# EAGLE schematic soccerbotsqr (EAGLE 8.2.2)

## Sheet 1 of 4
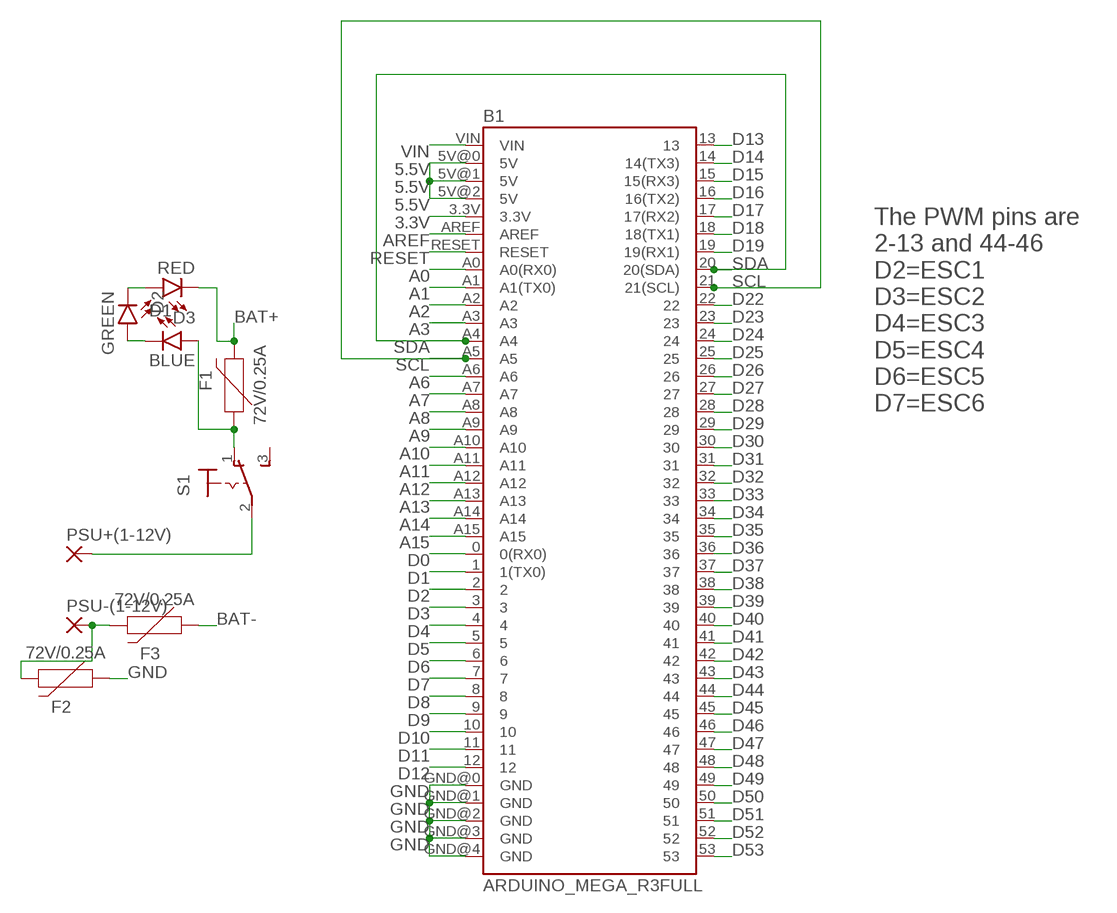
[diagram p0: schematic, sheet 1]

### Parts
B1  ARDUINO_MEGA_R3FULL  [ARDUINO_MEGA]
D1  BLUE  LED-BLUE1206  [LED-1206]
D2  GREEN  LED-GREEN0603  [LED-0603]
D3  RED  LED-RED0603  [LED-0603]
F1  72V/0.25A  PPTC_PTH  [PTH]
F2  72V/0.25A  PPTC_PTH  [PTH]
F3  72V/0.25A  PPTC_PTH  [PTH]
PSU+(1-12V)  SMD5  [SMD2,54-5,08]
PSU-(1-12V)  SMD5  [SMD2,54-5,08]
S1  320-916  [320-916]

### Nets
3.3V: B1.3.3V ; also sheet 2
5.5V: B1.5V@0(5V) B1.5V@1(5V) B1.5V@2(5V)
A0: B1.A0(A0(RX0))
A1: B1.A1(A1(TX0))
A2: B1.A2
A3: B1.A3
A6: B1.A6
A7: B1.A7
A8: B1.A8
A9: B1.A9
A10: B1.A10
A11: B1.A11
A12: B1.A12
A13: B1.A13
A14: B1.A14
A15: B1.A15
AREF: B1.AREF
BAT+: D3.C F1.P$2 ; also sheet 4
BAT-: F2.P$2 F3.P$1 F3.P$2 PSU-(1-12V).1(P) ; also sheet 4
D0: B1.0(0(RX0))
D1: B1.1(1(TX0))
D2: B1.2 ; also sheet 4
D3: B1.3 ; also sheet 4
D4: B1.4 ; also sheet 4
D5: B1.5 ; also sheet 4
D6: B1.6 ; also sheet 4
D7: B1.7 ; also sheet 4
D8: B1.8
D9: B1.9
D10: B1.10
D11: B1.11
D12: B1.12
D13: B1.13
D14: B1.14(14(TX3))
D15: B1.15(15(RX3))
D16: B1.16(16(TX2))
D17: B1.17(17(RX2))
D18: B1.18(18(TX1))
D19: B1.19(19(RX1))
D22: B1.22
D23: B1.23
D24: B1.24
D25: B1.25
D26: B1.26
D27: B1.27
D28: B1.28
D29: B1.29
D30: B1.30
D31: B1.31
D32: B1.32
D33: B1.33
D34: B1.34
D35: B1.35
D36: B1.36
D37: B1.37
D38: B1.38
D39: B1.39
D40: B1.40
D41: B1.41
D42: B1.42
D43: B1.43
D44: B1.44
D45: B1.45
D46: B1.46
D47: B1.47
D48: B1.48
D49: B1.49
D50: B1.50
D51: B1.51
D52: B1.52
D53: B1.53
GND: B1.GND@0(GND) B1.GND@1(GND) B1.GND@2(GND) B1.GND@3(GND) B1.GND@4(GND) F2.P$1 ; also sheet 2,3,4
N$3: D1.C D2.A
N$4: PSU+(1-12V).1(P) S1.2(P)
N$5: D2.C D3.A
N$6: D1.A F1.P$1 S1.1(O)
RESET: B1.RESET
SCL: B1.21(21(SCL)) B1.A5 ; also sheet 2,3
SDA: B1.20(20(SDA)) B1.A4 ; also sheet 2,3
VIN: B1.VIN ; also sheet 2,3,4
Unconnected: S1.3(S)

### Notes on the sheet
- The PWM pins are
  2-13 and 44-46
  D2=ESC1
  D3=ESC2
  D4=ESC3
  D5=ESC4
  D6=ESC5
  D7=ESC6

## Sheet 2 of 4
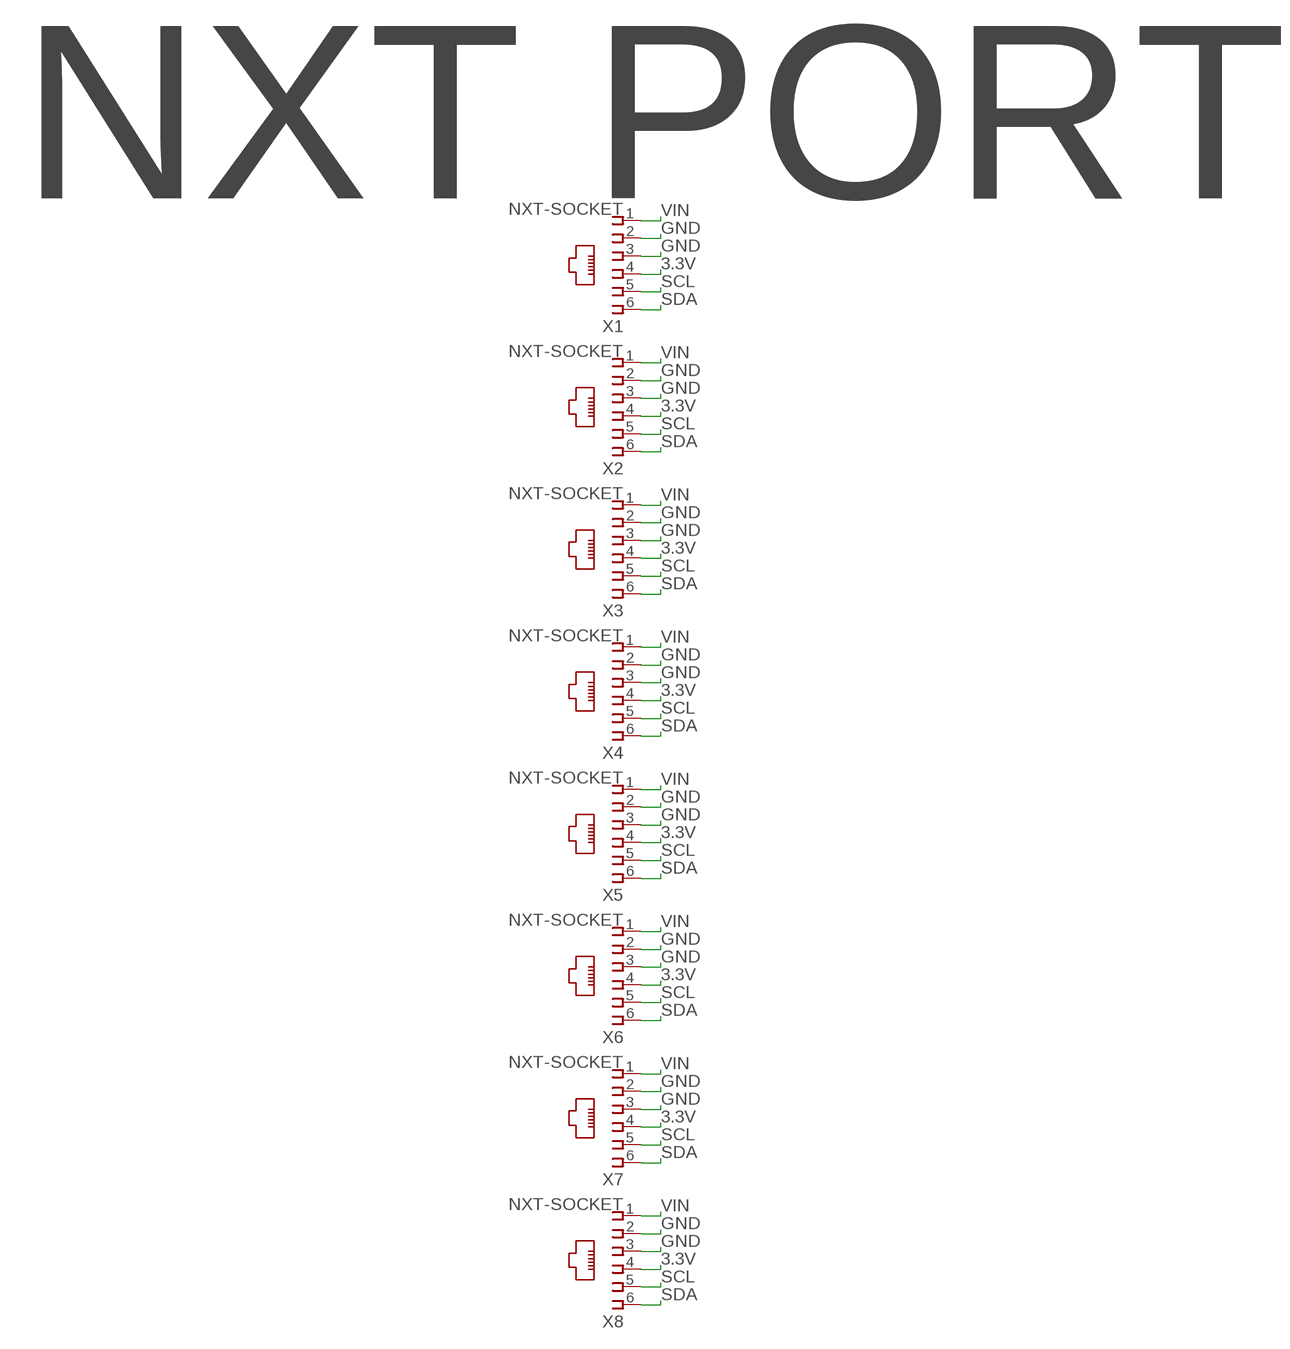
[diagram p1: schematic, sheet 2]

### Parts
X1  NXT-SOCKET  [NXT-SOCKET]
X2  NXT-SOCKET  [NXT-SOCKET]
X3  NXT-SOCKET  [NXT-SOCKET]
X4  NXT-SOCKET  [NXT-SOCKET]
X5  NXT-SOCKET  [NXT-SOCKET]
X6  NXT-SOCKET  [NXT-SOCKET]
X7  NXT-SOCKET  [NXT-SOCKET]
X8  NXT-SOCKET  [NXT-SOCKET]

### Nets
3.3V: X1.4 X2.4 X3.4 X4.4 X5.4 X6.4 X7.4 X8.4 ; also sheet 1
GND: X1.2 X1.3 X2.2 X2.3 X3.2 X3.3 X4.2 X4.3 X5.2 X5.3 X6.2 X6.3 X7.2 X7.3 X8.2 X8.3 ; also sheet 1,3,4
SCL: X1.5 X2.5 X3.5 X4.5 X5.5 X6.5 X7.5 X8.5 ; also sheet 1,3
SDA: X1.6 X2.6 X3.6 X4.6 X5.6 X6.6 X7.6 X8.6 ; also sheet 1,3
VIN: X1.1 X2.1 X3.1 X4.1 X5.1 X6.1 X7.1 X8.1 ; also sheet 1,3,4

### Notes on the sheet
- NXT PORTS

## Sheet 3 of 4
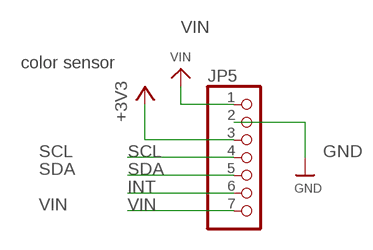
[diagram p2: schematic, sheet 3]

### Parts
JP5  HEADER-1X770MIL  [1X07_ROUND_70]

### Nets
+3V3: JP5.3
GND: JP5.2 ; also sheet 1,2,4
INT: JP5.6
SCL: JP5.4 ; also sheet 1,2
SDA: JP5.5 ; also sheet 1,2
VIN: JP5.1 JP5.7 ; also sheet 1,2,4

### Notes on the sheet
- color sensor

## Sheet 4 of 4
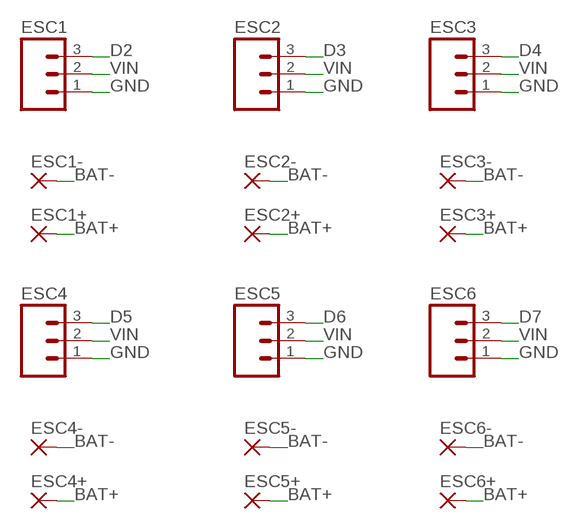
[diagram p3: schematic, sheet 4]

### Parts
ESC1  M03LOCK  [1X03_LOCK]
ESC1+  SMD5  [SMD2,54-5,08]
ESC1-  SMD5  [SMD2,54-5,08]
ESC2  M03LOCK  [1X03_LOCK]
ESC2+  SMD5  [SMD2,54-5,08]
ESC2-  SMD5  [SMD2,54-5,08]
ESC3  M03LOCK  [1X03_LOCK]
ESC3+  SMD5  [SMD2,54-5,08]
ESC3-  SMD5  [SMD2,54-5,08]
ESC4  M03LOCK  [1X03_LOCK]
ESC4+  SMD5  [SMD2,54-5,08]
ESC4-  SMD5  [SMD2,54-5,08]
ESC5  M03LOCK  [1X03_LOCK]
ESC5+  SMD5  [SMD2,54-5,08]
ESC5-  SMD5  [SMD2,54-5,08]
ESC6  M03LOCK  [1X03_LOCK]
ESC6+  SMD5  [SMD2,54-5,08]
ESC6-  SMD5  [SMD2,54-5,08]

### Nets
BAT+: ESC1+.1(P) ESC2+.1(P) ESC3+.1(P) ESC4+.1(P) ESC5+.1(P) ESC6+.1(P) ; also sheet 1
BAT-: ESC1-.1(P) ESC2-.1(P) ESC3-.1(P) ESC4-.1(P) ESC5-.1(P) ESC6-.1(P) ; also sheet 1
D2: ESC1.3 ; also sheet 1
D3: ESC2.3 ; also sheet 1
D4: ESC3.3 ; also sheet 1
D5: ESC4.3 ; also sheet 1
D6: ESC5.3 ; also sheet 1
D7: ESC6.3 ; also sheet 1
GND: ESC1.1 ESC2.1 ESC3.1 ESC4.1 ESC5.1 ESC6.1 ; also sheet 1,2,3
VIN: ESC1.2 ESC2.2 ESC3.2 ESC4.2 ESC5.2 ESC6.2 ; also sheet 1,2,3

## Library data of the parts
B1 = SparkFun-Boards:ARDUINO_MEGA_R3: Arduino Mega R3 ATmega2560 R3 compatible footprint. SparkFun Products: Arduino Mega 2560 R3 <https://www.sparkfun.com/products/11061>; OC_NEWARK: unknown
D1 = SparkFun-LED:LED-BLUE: Blue SMD LED Used in manufacturing of various products at SparkFun Packages: 0603 - SMD 0603 package [Product Link] <http://www.digikey.com/product-detail/en/SMLE12BC7TT86/511-1589-2-ND/1641808> 1206 - SMD1206 package [Product Link] <http://www.digikey.com/product-detail/en/lite-on-inc/LTST-C150TBKT/160-1643-1-ND/573584> SparkFun Products: ESP8266 Thing-Dev Board <https://www.sparkfun.com/products/13711> RedBoard <https://www.sparkfun.com/products/12757>; MPN: TLMB1100-GS08; OC_NEWARK: 03P9480; PROD_ID: DIO-09911
D2 = SparkFun-LED:LED-GREEN: Green SMD LED Used in manufacturing of various products at SparkFun Packages: 0603 - SMD 0603 package [Product Link] <http://www.futureelectronics.com/en/technologies/semiconductors/optoelectronics/leds/Pages/9894312-LTST-C190GKT.aspx?CrossPart=HSMG-C190&IM=0> LilyPad 1206 - SMD1206 LilyPad package [Product Link] <http://www.futureelectronics.com/en/Technologies/Product.aspx?ProductID=IN150NGHARVATEKCORPORATION2049943&IM=0> 1206 - SMD1206 package [Product Link] <http://www.futureelectronics.com/en/technologies/semiconductors/optoelectronics/leds/Pages/8315665-LTST-C150KGKT.aspx?IM=0> 1206 Bottom Mount -SMD 1206 Bottom Mount [Product Link] <http://www.digikey.com/product-detail/en/lite-on-inc/LTST-C230KGKT/160-1456-1-ND/386854> SparkFun Products: Pro Mini 328 -5V <https://www.sparkfun.com/products/821> RedBoard <https://www.sparkfun.com/products/12757> MP3 Trigger <https://www.sparkfun.com/products/13720> Makey Makey <https://www.sparkfun.com/products/11076>; MF: SLI (CML/IDI); MPN: CMD15-21VGC/TR8; OC_NEWARK: 15M8857; PROD_ID: DIO-00821
D3 = SparkFun-LED:LED-RED: Red SMD LED Used in manufacturing of most products at SparkFun Packages: 0603 - SMD 0603 package [Product Link] <http://docs.avagotech.com/docs/AV02-0551EN> 0603 SMART - SMD 0603 SMART package ( more efficient and expensive)[Product Link] <http://www.osram-os.com/Graphics/XPic2/00077099_0.pdf> 1206 - SMD1206 package [Product Link] <https://www.sparkfun.com/datasheets/DevTools/LilyPad/Q150OVS4.pdff> SparkFun Products: Pro Mini 328 -5V <https://www.sparkfun.com/products/821> RedBoard <https://www.sparkfun.com/products/12757> IOIO-OTG <https://www.sparkfun.com/products/13613>; MPN: LSQ976-Z; OC_NEWARK: 05M0541; PROD_ID: DIO-00819
ESC1-ESC6 = SparkFun:M03: Header 3 Standard 3-pin 0.1" header. Use with straight break away headers (SKU : PRT-00116), right angle break away headers (PRT-00553), swiss pins (PRT-00743), machine pins (PRT-00117), and female headers (PRT-00115). Molex polarized connector foot print use with SKU : PRT-08232 with associated crimp pins and housings.; MF: MOLEX; MPN: 22-11-2032; OC_NEWARK: 81C8218
ESC1+ ESC1- ESC2+ ESC2- ESC3+ ESC3- ESC4+ ESC4- ESC5+ ESC5- ESC6+ ESC6- PSU+(1-12V) PSU-(1-12V) = wirepad:SMD5: SMD PAD; OC_NEWARK: unknown
F1-F3 = SparkFun-Fuses:PPTC: Resettable Fuse PPTC Resettable Fuse. Really a sort of resistor with a polymeric positive temperature coefficient whose resistance increases dramatically with an increase in temperature. When heated by the power passing through the resistance rises causing the current to be limited, protecting the circuit. This is achieved by the transition of the polymer from a crystalline to an amorphous state where the conductive carbon separates breaking the conductive pathways found in the cool crystalline structure. When a PPTC cools back down it resumes conducting letting the circuit turn back on. SparkFun Products: SparkFun RedBoard - Programmed with Arduino <https://www.sparkfun.com/products/12757> Pro Micro - 5V/16MHz <https://www.sparkfun.com/products/12640> Arduino Pro 328 - 5V/16MHz <https://www.sparkfun.com/products/10915> MP3 Trigger <https://www.sparkfun.com/products/13720>; MF: RAYCHEM/POLYSWITCH; MPN: RGEF250; OC_NEWARK: 04H7805; PROD_ID: RES-08490
JP5 = microbuilder:HEADER-1X7: PIN HEADER; OC_NEWARK: unknown
S1 = switch:320-916: TOGGLE SWITCH distributor RS Components; MPN: 5636A9; OC_NEWARK: 13M4539
X1-X8 = NXT Compatible (female) Sockets - Mindsensors:NXT-SOCKET: RJ11 6 connects Manufacturer: Mindsensors.com Source: NXT-Female-Socket.pdf; OC_FARNELL: unknown; OC_NEWARK: unknown